# Altium project LPC55S69_MINI [A].PrjPcb
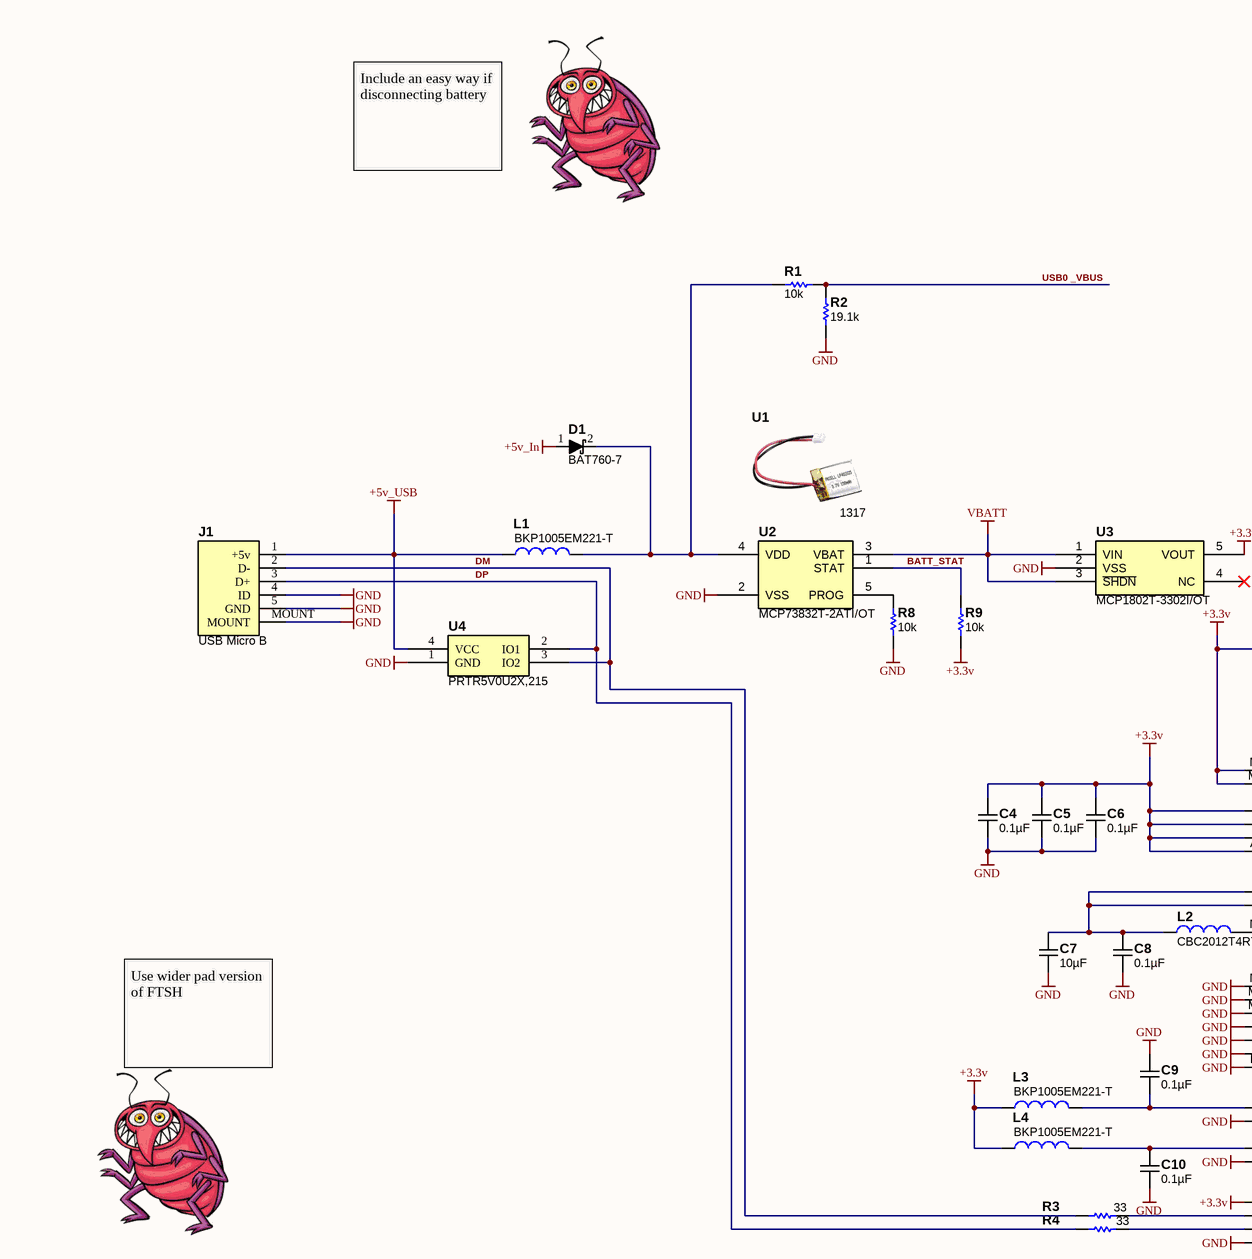
[diagram p0: LPC55S69_MINI [A].SchDoc, top left]
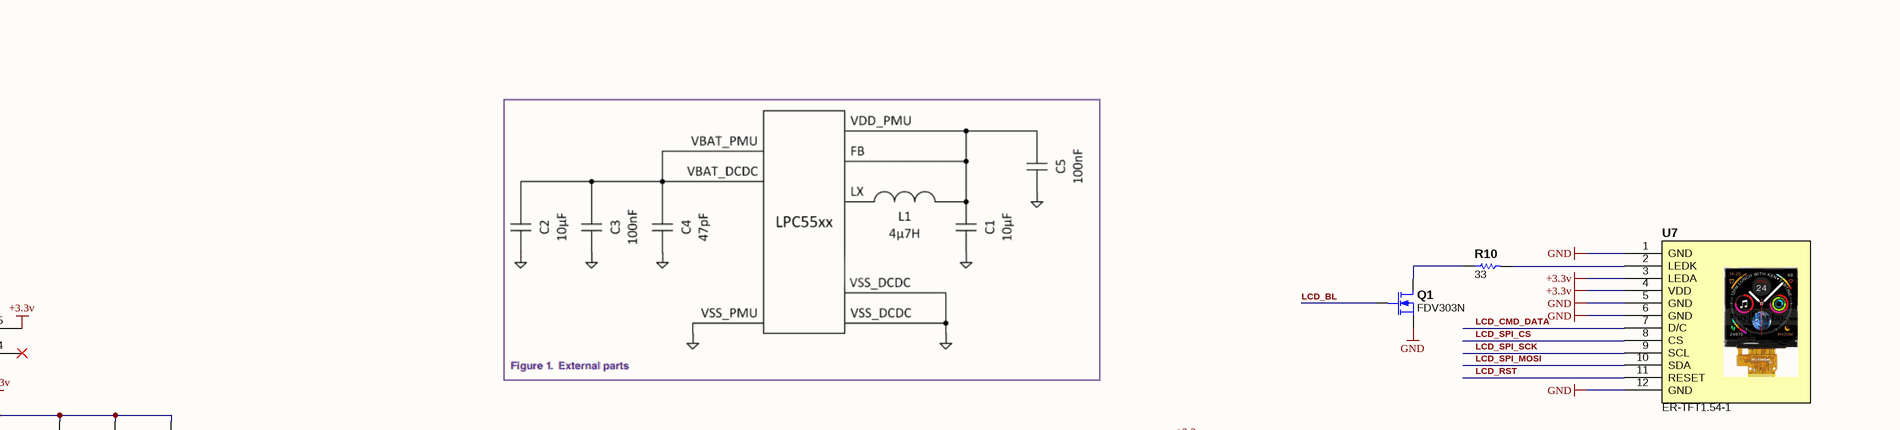
[diagram p1: LPC55S69_MINI [A].SchDoc, top right]
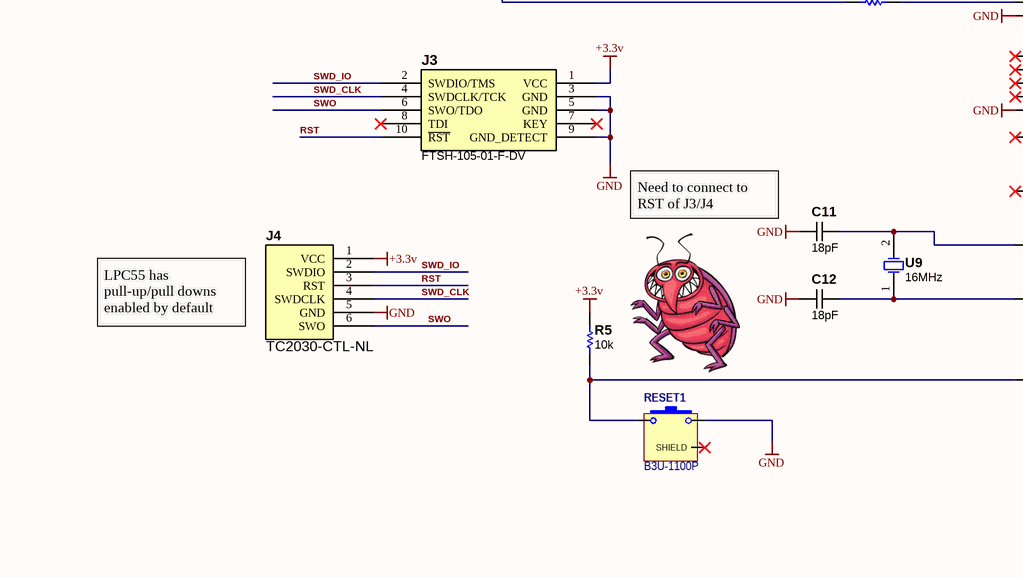
[diagram p2: LPC55S69_MINI [A].SchDoc, bottom left]
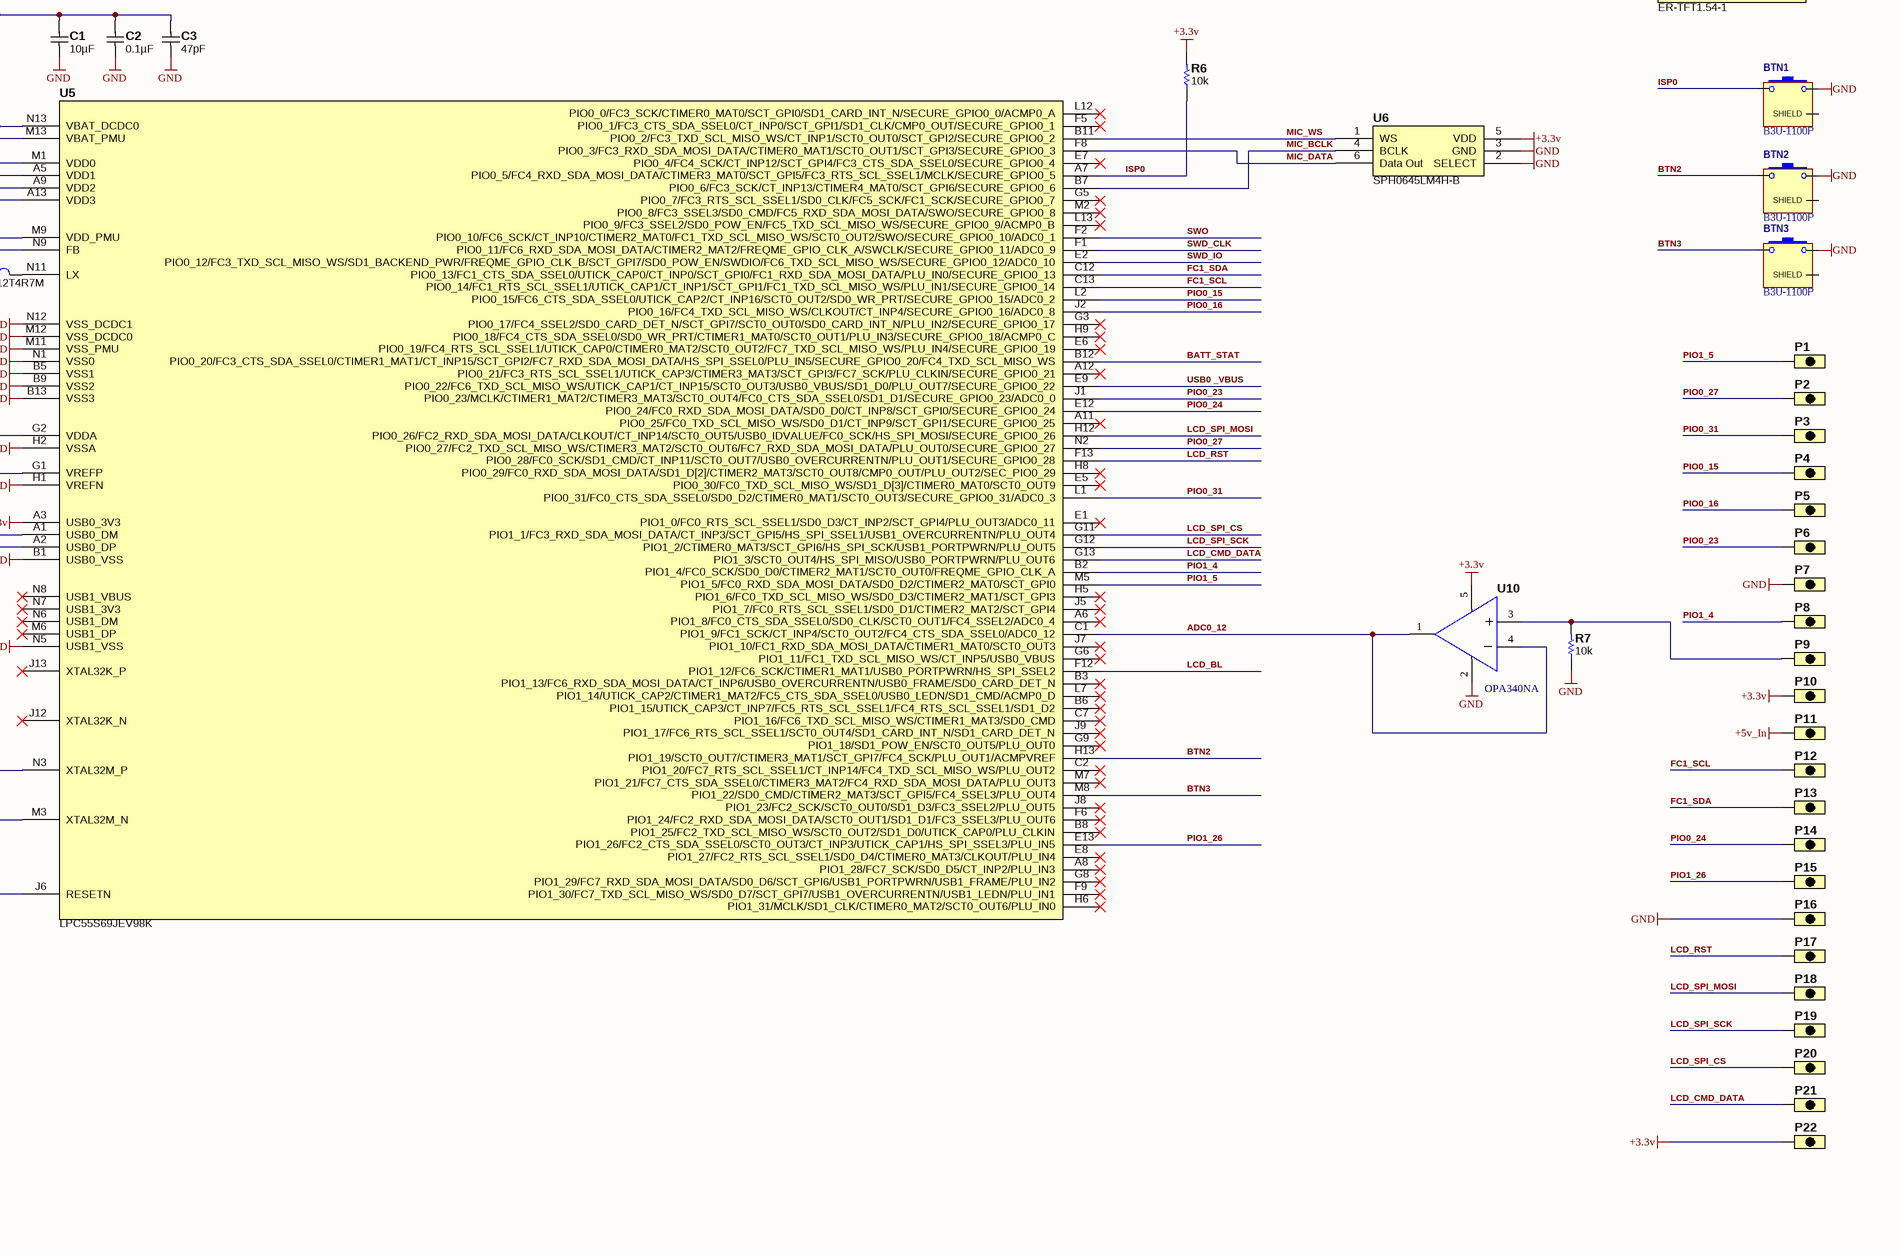
[diagram p3: LPC55S69_MINI [A].SchDoc, bottom right]
APPROVAL_APPROVED_1: -; APPROVAL_APPROVED_1_DATE: -; APPROVAL_APPROVED_2: -; APPROVAL_APPROVED_2_DATE: -; APPROVAL_CHECKED_DATE: -; APPROVAL_DRAWN: -; APPROVAL_DRAWN_DATE: -; APPROVAL_ENGINEER: -; APPROVAL_ENGINEER_DATE: -; APPROVAL_REVIEWED: -; APPROVAL_REVIEWED_DATE: -; BOM_NOTES_LINE_1: -; BOM_NOTES_LINE_2: -; BOM_NOTES_LINE_3: -; BOM_NOTES_LINE_4: -; CCA_PART_NUMBER: LPC55S69_MINI; CCA_TITLE: LPC55S69_MINI; PCB_COPPER_WEIGHT_INNER: 1oz; PCB_COPPER_WEIGHT_OUTER: 1oz; PCB_DRC_DATE: X; PCB_FINISH_PLATING: GOLD ENIG; PCB_FINISHED_THICKNESS: 62.5mil; PCB_LAYERS: 2; PCB_MATERIAL: FR4; PCB_MIN_DRILL: 12mil; PCB_MIN_TRACE_SPACE: 6mil; PCB_MIN_TRACE_WIDTH: 6mil; PCB_PART_NUMBER: LPC55S69_MINI; PCB_PRINTOUT_SCALE: 1:1; PCB_SILKSCREEN_COLOR_BOTTOM: WHITE; PCB_SILKSCREEN_COLOR_TOP: WHITE; PCB_SOLDER_MASK_COLOR_BOTTOM: GREEN; PCB_SOLDER_MASK_COLOR_TOP: GREEN; PCB_TITLE: LPC55S69_MINI; PCB_VERSION: A; PROJECT_ENGINEER: E. Hughes; PROJECT_STATUS: PRODUCTION; PROJECT_TITLE_LINE_1: LPC55S69_MINI; SCH_DATE: 2019-01-28
1 sheet, 66 parts. Net scope: global (net labels, ports and power ports of the same name join across sheets).
Board file: LPC55S69_MINI [A].PCBdoc

## Sheet LPC55S69_MINI [A].SchDoc
size D; Organization: Altium Limited; Address1: 3 Minna Close; Address2: Belrose; Address3: NSW 2085; Address4: Australia; DocumentNumber: 1; SheetNumber: 1; SheetTotal: 1

### Parts
BTN1  B3U-1100P  [OMRON_B3U-1100P]
BTN2  B3U-1100P  [OMRON_B3U-1100P]
BTN3  B3U-1100P  [OMRON_B3U-1100P]
C1  10µF  [C0805_1.45MM_MD]
C2  0.1µF  [C0402_0.55MM_MD]
C3  47pF  [C0402_0.55MM_MD]
C4  0.1µF  [C0402_0.55MM_MD]
C5  0.1µF  [C0402_0.55MM_MD]
C6  0.1µF  [C0402_0.55MM_MD]
C7  10µF  [C0805_1.45MM_MD]
C8  0.1µF  [C0402_0.55MM_MD]
C9  0.1µF  [C0402_0.55MM_MD]
C10  0.1µF  [C0402_0.55MM_MD]
C11  18pF  [C0402_0.55MM_MD]
C12  18pF  [C0402_0.55MM_MD]
D1  BAT760-7  [D_SOD-323_P]
J1  USB Micro B  [10103594-0001LF]
J3  FTSH-105-01-F-DV  [FTSH-105-04-F-DV - HD - NO_STEP]
J4  TC2030‐CTL‐NL  [TC2030 NO LATCH]  (no BOM)
L1  BKP1005EM221-T  [C0402_HD]
L2  CBC2012T4R7M  [C0805_1.45MM_MD]
L3  BKP1005EM221-T  [C0402_HD]
L4  BKP1005EM221-T  [C0402_HD]
P1  (no value)  [CASTELLATED]  (no BOM)
P2  (no value)  [CASTELLATED]  (no BOM)
P3  (no value)  [CASTELLATED]  (no BOM)
P4  (no value)  [CASTELLATED]  (no BOM)
P5  (no value)  [CASTELLATED]  (no BOM)
P6  (no value)  [CASTELLATED]  (no BOM)
P7  (no value)  [CASTELLATED]  (no BOM)
P8  (no value)  [CASTELLATED]  (no BOM)
P9  (no value)  [CASTELLATED]  (no BOM)
P10  (no value)  [CASTELLATED]  (no BOM)
P11  (no value)  [CASTELLATED]  (no BOM)
P12  (no value)  [CASTELLATED]  (no BOM)
P13  (no value)  [CASTELLATED]  (no BOM)
P14  (no value)  [CASTELLATED]  (no BOM)
P15  (no value)  [CASTELLATED]  (no BOM)
P16  (no value)  [CASTELLATED]  (no BOM)
P17  (no value)  [CASTELLATED]  (no BOM)
P18  (no value)  [CASTELLATED]  (no BOM)
P19  (no value)  [CASTELLATED]  (no BOM)
P20  (no value)  [CASTELLATED]  (no BOM)
P21  (no value)  [CASTELLATED]  (no BOM)
P22  (no value)  [CASTELLATED]  (no BOM)
Q1  FDV303N  [SOT-23]
R1  10k  [R0402_0.40MM_MD]
R2  19.1k  [R0402_0.40MM_MD]
R3  33  [R0603_0.55MM_MD]
R4  33  [R0603_0.55MM_MD]
R5  10k  [R0402_0.40MM_MD]
R6  10k  [R0402_0.40MM_MD]
R7  10k  [R0402_0.40MM_MD]
R8  10k  [R0402_0.40MM_MD]
R9  10k  [R0402_0.40MM_MD]
R10  33  [R0603_0.55MM_MD]
RESET1  B3U-1100P  [OMRON_B3U-1100P]
U1  1317  [LIPO-150MAH]
U2  MCP73832T-2ATI/OT  [SOT23-5]
U3  MCP1802T-3302I/OT  [SOT23-5]
U4  PRTR5V0U2X,215  [SOT143B]
U5  LPC55S69JEV98K  [98-VFBGA]
U6  SPH0645LM4H-B  [SPH0645LM4H-B]
U7  ER-TFT1.54-1  [ER-TFT1.54-1]
U9  16MHz  [ABM3]
U10  value OPA340NA  [SOT95P245X145-5L]  (hidden comment: IC SINGLE SUPPLY OPAMP SOT-23-5)

### Nets
+3.3v: C1.2 C2.2 C3.2 C4.2 C5.2 C6.2 J3.1(VCC) J4.1(VCC) L3.1 L4.1 P10.1 P22.1 R5.2 R6.2 R9.1 U3.5(VOUT) U5.A3(USB0_3V3) U5.A5(VDD1) U5.A9(VDD2) U5.A13(VDD3) U5.M1(VDD0) U5.M13(VBAT_PMU) U5.N13(VBAT_DCDC0) U6.5(VDD) U7.3(LEDA) U7.4(VDD) U10.5(VCC)
+5v_In: D1.1(A) P11.1
+5v_USB: J1.1(+5v) L1.1 U4.4(VCC)
GND: BTN1.1 BTN2.1 BTN3.1 C1.1 C2.1 C3.1 C4.1 C5.1 C6.1 C7.1 C8.1 C9.2 C10.1 C11.1 C12.1 J1.4(ID) J1.5(GND) J1.MOUNT J3.3(GND) J3.5(GND) J3.9(GND_DETECT) J4.5(GND) P7.1 P16.1 Q1.2(S) R2.1 R7.1 R8.1 RESET1.1 U2.2(VSS) U3.2(VSS) U4.1(GND) U5.B1(USB0_VSS) U5.B5(VSS1) U5.B9(VSS2) U5.B13(VSS3) U5.H1(VREFN) U5.H2(VSSA) U5.M11(VSS_PMU) U5.M12(VSS_DCDC0) U5.N1(VSS0) U5.N5(USB1_VSS) U5.N12(VSS_DCDC1) U6.2(SELECT) U6.3(GND) U7.1(GND) U7.5(GND) U7.6(GND) U7.12(GND) U10.2(GND)
VBATT: U2.3(VBAT) U3.1(VIN) U3.3(~{SHDN})
ADC0_12: U5.C1(PIO1_9/FC1_SCK/CT_INP4/SCT0_OUT2/FC4_CTS_SDA_SSEL0/ADC0_12) U10.1(OUT) U10.4(-)
BATT_STAT: R9.2 U2.1(STAT) U5.B12(PIO0_20/FC3_CTS_SDA_SSEL0/CTIMER1_MAT1/CT_INP15/SCT_GPI2/FC7_RXD_SDA_MOSI_DATA/HS_SPI_SSEL0/PLU_IN5/SECURE_GPIO0_20/FC4_TXD_SCL_MISO_WS)
BTN2: BTN2.2 U5.H13(PIO1_19/SCT0_OUT7/CTIMER3_MAT1/SCT_GPI7/FC4_SCK/PLU_OUT1/ACMPVREF)
BTN3: BTN3.2 U5.M8(PIO1_22/SD0_CMD/CTIMER2_MAT3/SCT_GPI5/FC4_SSEL3/PLU_OUT4)
DM: J1.2(D-) R3.1 U4.3(IO2)
DP: J1.3(D+) R4.1 U4.2(IO1)
FC1_SCL: P12.1 U5.C13(PIO0_14/FC1_RTS_SCL_SSEL1/UTICK_CAP1/CT_INP1/SCT_GPI1/FC1_TXD_SCL_MISO_WS/PLU_IN1/SECURE_GPIO0_14)
FC1_SDA: P13.1 U5.C12(PIO0_13/FC1_CTS_SDA_SSEL0/UTICK_CAP0/CT_INP0/SCT_GPI0/FC1_RXD_SDA_MOSI_DATA/PLU_IN0/SECURE_GPIO0_13)
ISP0: BTN1.2 R6.1 U5.A7(PIO0_5/FC4_RXD_SDA_MOSI_DATA/CTIMER3_MAT0/SCT_GPI5/FC3_RTS_SCL_SSEL1/MCLK/SECURE_GPIO0_5)
LCD_BL: Q1.1(G) U5.F12(PIO1_12/FC6_SCK/CTIMER1_MAT1/USB0_PORTPWRN/HS_SPI_SSEL2)
LCD_CMD_DATA: P21.1 U5.G13(PIO1_3/SCT0_OUT4/HS_SPI_MISO/USB0_PORTPWRN/PLU_OUT6) U7.7(D/C)
LCD_RST: P17.1 U5.F13(PIO0_28/FC0_SCK/SD1_CMD/CT_INP11/SCT0_OUT7/USB0_OVERCURRENTN/PLU_OUT1/SECURE_GPIO0_28) U7.11(RESET)
LCD_SPI_CS: P20.1 U5.G11(PIO1_1/FC3_RXD_SDA_MOSI_DATA/CT_INP3/SCT_GPI5/HS_SPI_SSEL1/USB1_OVERCURRENTN/PLU_OUT4) U7.8(CS)
LCD_SPI_MOSI: P18.1 U5.H12(PIO0_26/FC2_RXD_SDA_MOSI_DATA/CLKOUT/CT_INP14/SCT0_OUT5/USB0_IDVALUE/FC0_SCK/HS_SPI_MOSI/SECURE_GPIO0_26) U7.10(SDA)
LCD_SPI_SCK: P19.1 U5.G12(PIO1_2/CTIMER0_MAT3/SCT_GPI6/HS_SPI_SCK/USB1_PORTPWRN/PLU_OUT5) U7.9(SCL)
MIC_BCLK: U5.B7(PIO0_6/FC3_SCK/CT_INP13/CTIMER4_MAT0/SCT_GPI6/SECURE_GPIO0_6) U6.4(BCLK)
MIC_DATA: U5.F8(PIO0_3/FC3_RXD_SDA_MOSI_DATA/CTIMER0_MAT1/SCT0_OUT1/SCT_GPI3/SECURE_GPIO0_3) U6.6(Data_Out)
MIC_WS: U5.B11(PIO0_2/FC3_TXD_SCL_MISO_WS/CT_INP1/SCT0_OUT0/SCT_GPI2/SECURE_GPIO0_2) U6.1(WS)
PIO0_15: P4.1 U5.L2(PIO0_15/FC6_CTS_SDA_SSEL0/UTICK_CAP2/CT_INP16/SCT0_OUT2/SD0_WR_PRT/SECURE_GPIO0_15/ADC0_2)
PIO0_16: P5.1 U5.J2(PIO0_16/FC4_TXD_SCL_MISO_WS/CLKOUT/CT_INP4/SECURE_GPIO0_16/ADC0_8)
PIO0_23: P6.1 U5.J1(PIO0_23/MCLK/CTIMER1_MAT2/CTIMER3_MAT3/SCT0_OUT4/FC0_CTS_SDA_SSEL0/SD1_D1/SECURE_GPIO0_23/ADC0_0)
PIO0_24: P14.1 U5.E12(PIO0_24/FC0_RXD_SDA_MOSI_DATA/SD0_D0/CT_INP8/SCT_GPI0/SECURE_GPIO0_24)
PIO0_27: P2.1 U5.N2(PIO0_27/FC2_TXD_SCL_MISO_WS/CTIMER3_MAT2/SCT0_OUT6/FC7_RXD_SDA_MOSI_DATA/PLU_OUT0/SECURE_GPIO0_27)
PIO0_31: P3.1 U5.L1(PIO0_31/FC0_CTS_SDA_SSEL0/SD0_D2/CTIMER0_MAT1/SCT0_OUT3/SECURE_GPIO0_31/ADC0_3)
PIO1_4: P8.1 U5.B2(PIO1_4/FC0_SCK/SD0_D0/CTIMER2_MAT1/SCT0_OUT0/FREQME_GPIO_CLK_A)
PIO1_5: P1.1 U5.M5(PIO1_5/FC0_RXD_SDA_MOSI_DATA/SD0_D2/CTIMER2_MAT0/SCT_GPI0)
PIO1_26: P15.1 U5.E13(PIO1_26/FC2_CTS_SDA_SSEL0/SCT0_OUT3/CT_INP3/UTICK_CAP1/HS_SPI_SSEL3/PLU_IN5)
RST: J3.10(~{RST}) J4.3(RST)
SWD_CLK: J3.4(SWDCLK/TCK) J4.4(SWDCLK) U5.F1(PIO0_11/FC6_RXD_SDA_MOSI_DATA/CTIMER2_MAT2/FREQME_GPIO_CLK_A/SWCLK/SECURE_GPIO0_11/ADC0_9)
SWD_IO: J3.2(SWDIO/TMS) J4.2(SWDIO) U5.E2(PIO0_12/FC3_TXD_SCL_MISO_WS/SD1_BACKEND_PWR/FREQME_GPIO_CLK_B/SCT_GPI7/SD0_POW_EN/SWDIO/FC6_TXD_SCL_MISO_WS/SECURE_GPIO0_12/ADC0_10)
SWO: J3.6(SWO/TDO) J4.6(SWO) U5.F2(PIO0_10/FC6_SCK/CT_INP10/CTIMER2_MAT0/FC1_TXD_SCL_MISO_WS/SCT0_OUT2/SWO/SECURE_GPIO0_10/ADC0_1)
USB0 _VBUS: R1.2 R2.2 U5.E9(PIO0_22/FC6_TXD_SCL_MISO_WS/UTICK_CAP1/CT_INP15/SCT0_OUT3/USB0_VBUS/SD1_D0/PLU_OUT7/SECURE_GPIO0_22)
NetC7_2: C7.2 C8.2 L2.1 U5.M9(VDD_PMU) U5.N9(FB)
NetC9_1: C9.1 L3.2 U5.G2(VDDA)
NetC10_2: C10.2 L4.2 U5.G1(VREFP)
NetC11_2: C11.2 U5.N3(XTAL32M_P) U9.2(OSC2)
NetC12_2: C12.2 U5.M3(XTAL32M_N) U9.1(OSC1)
NetD1_2: D1.2(K) L1.2 R1.1 U2.4(VDD)
NetL2_2: L2.2 U5.N11(LX)
NetP9_1: P9.1 R7.2 U10.3(+)
NetQ1_3: Q1.3(D) R10.1
NetR3_2: R3.2 U5.A1(USB0_DM)
NetR4_2: R4.2 U5.A2(USB0_DP)
NetR5_1: R5.1 RESET1.2 U5.J6(RESETN)
NetR8_2: R8.2 U2.5(PROG)
NetR10_2: R10.2 U7.2(LEDK)

Not connected (* = marked no-connect by the designer): BTN1 S(SHIELD); BTN2 S(SHIELD); BTN3 S(SHIELD); J3 7(KEY)* 8(TDI)*; RESET1 S(SHIELD)*; U3 4(NC)*; U5 A6(PIO1_8/FC0_CTS_SDA_SSEL0/SD0_CLK/SCT0_OUT1/FC4_SSEL2/ADC0_4)* A8(PIO1_28/FC7_SCK/SD0_D5/CT_INP2/PLU_IN3)* A11(PIO0_25/FC0_TXD_SCL_MISO_WS/SD0_D1/CT_INP9/SCT_GPI1/SECURE_GPIO0_25)* A12(PIO0_21/FC3_RTS_SCL_SSEL1/UTICK_CAP3/CTIMER3_MAT3/SCT_GPI3/FC7_SCK/PLU_CLKIN/SECURE_GPIO0_21)* B3(PIO1_13/FC6_RXD_SDA_MOSI_DATA/CT_INP6/USB0_OVERCURRENTN/USB0_FRAME/SD0_CARD_DET_N)* B6(PIO1_15/UTICK_CAP3/CT_INP7/FC5_RTS_SCL_SSEL1/FC4_RTS_SCL_SSEL1/SD1_D2)* B8(PIO1_25/FC2_TXD_SCL_MISO_WS/SCT0_OUT2/SD1_D0/UTICK_CAP0/PLU_CLKIN)* C2(PIO1_20/FC7_RTS_SCL_SSEL1/CT_INP14/FC4_TXD_SCL_MISO_WS/PLU_OUT2)* C7(PIO1_16/FC6_TXD_SCL_MISO_WS/CTIMER1_MAT3/SD0_CMD)* E1(PIO1_0/FC0_RTS_SCL_SSEL1/SD0_D3/CT_INP2/SCT_GPI4/PLU_OUT3/ADC0_11)* E5(PIO0_30/FC0_TXD_SCL_MISO_WS/SD1_D[3]/CTIMER0_MAT0/SCT0_OUT9)* E6(PIO0_19/FC4_RTS_SCL_SSEL1/UTICK_CAP0/CTIMER0_MAT2/SCT0_OUT2/FC7_TXD_SCL_MISO_WS/PLU_IN4/SECURE_GPIO0_19)* E7(PIO0_4/FC4_SCK/CT_INP12/SCT_GPI4/FC3_CTS_SDA_SSEL0/SECURE_GPIO0_4)* E8(PIO1_27/FC2_RTS_SCL_SSEL1/SD0_D4/CTIMER0_MAT3/CLKOUT/PLU_IN4)* F5(PIO0_1/FC3_CTS_SDA_SSEL0/CT_INP0/SCT_GPI1/SD1_CLK/CMP0_OUT/SECURE_GPIO0_1)* F6(PIO1_24/FC2_RXD_SDA_MOSI_DATA/SCT0_OUT1/SD1_D1/FC3_SSEL3/PLU_OUT6)* F9(PIO1_30/FC7_TXD_SCL_MISO_WS/SD0_D7/SCT_GPI7/USB1_OVERCURRENTN/USB1_LEDN/PLU_IN1)* G3(PIO0_17/FC4_SSEL2/SD0_CARD_DET_N/SCT_GPI7/SCT0_OUT0/SD0_CARD_INT_N/PLU_IN2/SECURE_GPIO0_17)* G5(PIO0_7/FC3_RTS_SCL_SSEL1/SD0_CLK/FC5_SCK/FC1_SCK/SECURE_GPIO0_7)* G6(PIO1_11/FC1_TXD_SCL_MISO_WS/CT_INP5/USB0_VBUS)* G8(PIO1_29/FC7_RXD_SDA_MOSI_DATA/SD0_D6/SCT_GPI6/USB1_PORTPWRN/USB1_FRAME/PLU_IN2)* G9(PIO1_18/SD1_POW_EN/SCT0_OUT5/PLU_OUT0)* H5(PIO1_6/FC0_TXD_SCL_MISO_WS/SD0_D3/CTIMER2_MAT1/SCT_GPI3)* H6(PIO1_31/MCLK/SD1_CLK/CTIMER0_MAT2/SCT0_OUT6/PLU_IN0)* H8(PIO0_29/FC0_RXD_SDA_MOSI_DATA/SD1_D[2]/CTIMER2_MAT3/SCT0_OUT8/CMP0_OUT/PLU_OUT2/SEC_PIO0_29)* H9(PIO0_18/FC4_CTS_SDA_SSEL0/SD0_WR_PRT/CTIMER1_MAT0/SCT0_OUT1/PLU_IN3/SECURE_GPIO0_18/ACMP0_C)* J5(PIO1_7/FC0_RTS_SCL_SSEL1/SD0_D1/CTIMER2_MAT2/SCT_GPI4)* J7(PIO1_10/FC1_RXD_SDA_MOSI_DATA/CTIMER1_MAT0/SCT0_OUT3)* J8(PIO1_23/FC2_SCK/SCT0_OUT0/SD1_D3/FC3_SSEL2/PLU_OUT5)* J9(PIO1_17/FC6_RTS_SCL_SSEL1/SCT0_OUT4/SD1_CARD_INT_N/SD1_CARD_DET_N)* J12(XTAL32K_N)* J13(XTAL32K_P)* L7(PIO1_14/UTICK_CAP2/CTIMER1_MAT2/FC5_CTS_SDA_SSEL0/USB0_LEDN/SD1_CMD/ACMP0_D)* L12(PIO0_0/FC3_SCK/CTIMER0_MAT0/SCT_GPI0/SD1_CARD_INT_N/SECURE_GPIO0_0/ACMP0_A)* L13(PIO0_9/FC3_SSEL2/SD0_POW_EN/FC5_TXD_SCL_MISO_WS/SECURE_GPIO0_9/ACMP0_B)* M2(PIO0_8/FC3_SSEL3/SD0_CMD/FC5_RXD_SDA_MOSI_DATA/SWO/SECURE_GPIO0_8)* M6(USB1_DP)* M7(PIO1_21/FC7_CTS_SDA_SSEL0/CTIMER3_MAT2/FC4_RXD_SDA_MOSI_DATA/PLU_OUT3)* N6(USB1_DM)* N7(USB1_3V3)* N8(USB1_VBUS)*

### Notes on the sheet
- Include an easy way if disconnecting battery
- Use wider pad version of FTSH
- (near C11) Need to connect to RST of J3/J4
- LPC55 has pull-up/pull downs enabled by default
- PCB REV
- CCA REV
- Sheet
- of

### Library data of the parts
BTN1-BTN3 RESET1 = B3U-1100P: SWITCH TACTILE SPST-NO 0.05A 12V; Manufacturer: Omron Electronics Inc-EMC Div; CategorySort: 700; Switch Function: Off-Mom; Contact Rating @ Voltage: 0.05A @ 12VDC; Actuator Type: Standard; Actuator Height off PCB, from Pins: 1.60mm; Actuator Orientation: Top Actuated; Outline: 3.00mm x 2.50mm; Illumination: Non-Illuminated; Operating Force: 153gf; Ingress Protection: Dust Proof; Switch Travel: 0.15mm; Mechanical Life: 200,000 Cycles; Value: B3U-1100P; Sort Value: *; Category: Switches; Supplier 1: Digi-Key; Supplier Part Number 1: SW1021CT-ND; Manufacturer Part Number: B3U-1100P; RoHS: RoHS Compliant; Stock 1: 45170; Pricing 1: 1=1.25, 10=1.201, 25=1.1332, 50=0.997, 100=0.9064, 250=0.86108, 500=0.83842, 1000=0.65714 (USD); Packaging: Cut Tape (CT); Circuit: SPST-NO; Mounting Type: Surface Mount; Termination Style: SMD (SMT) Tab; Illumination Voltage (Nominal): -; Illumination Type, Color: -; Features: Grounding Pin; Actuator Material: -; Operating Temperature: -25°C ~ 70°C; ComponentLink1URL: http://www.components.omron.com/components/web/PDFLIB.nsf/0/2DD3893C7DD33E9E862572900079E9D6/$file/B3U_1110.pdf; ComponentLink1Description: http://www.components.omron.com/components/web/PDFLIB.nsf/0/2DD3893C7DD33E9E862572900079E9D6/$file/B3U_1110.pdf
C1 C7 = CGA4J1X7R0J106K125AC: CAP CER 10UF 6.3V X7R 0805; Manufacturer: TDK Corporation; Tolerance: ±10%; Substitution Notes: 10µF , 6.3V , ±10% , X7R , -55°C ~ 125°C , AEC-Q200 , 0805; Value: 10µF; Temperature Coefficient: X7R; Manufacturer Part Number: CGA4J1X7R0J106K125AC; ComponentLink1Description: Datasheet (Internal); ComponentLink1URL: datasheets\TDK\mlcc_automotive_general_en.pdf; ComponentLink2Description: Datasheet (External); ComponentLink2URL: https://product.tdk.com/info/en/catalog/datasheets/mlcc_automotive_general_en.pdf; Supplier 1: Digikey; Supplier Part Number 1: 445-6971-1-ND; Category: Capacitors; Voltage - Rated: 6.3V; Features: -; Operating Temperature: -55°C ~ 125°C; Ratings: AEC-Q200; Package: 0805; Thickness (Max): 1.45MM
C2 C4-C6 C8-C10 = CGA2B1X7R1C104K050BC: CAP CER 0.1UF 16V X7R 0402; Manufacturer: TDK Corporation; Tolerance: ±10%; Substitution Notes: 0.1µF , 16V , ±10% , X7R , -55°C ~ 125°C , AEC-Q200 , 0402; Value: 0.1µF; Temperature Coefficient: X7R; Manufacturer Part Number: CGA2B1X7R1C104K050BC; ComponentLink1Description: Datasheet (Internal); ComponentLink1URL: datasheets\TDK\mlcc_automotive_general_en.pdf; ComponentLink2Description: Datasheet (External); ComponentLink2URL: https://product.tdk.com/info/en/catalog/datasheets/mlcc_automotive_general_en.pdf; Supplier 1: Digikey; Supplier Part Number 1: 445-5613-1-ND; Category: Capacitors; Voltage - Rated: 16V; Features: -; Operating Temperature: -55°C ~ 125°C; Ratings: AEC-Q200; Package: 0402; Thickness (Max): 0.55MM
C3 = CGA2B2C0G1H470J050BA: CAP CER 47PF 50V C0G 0402; Manufacturer: TDK Corporation; Temperature Coefficient: C0G, NP0; Tolerance: ±5%; Substitution Notes: 47pF , 50V , ±5% , C0G, NP0 , -55°C ~ 125°C , AEC-Q200 , 0402; Value: 47pF; Manufacturer Part Number: CGA2B2C0G1H470J050BA; ComponentLink1Description: Datasheet (Internal); ComponentLink1URL: datasheets\TDK\mlcc_automotive_general_en.pdf; ComponentLink2Description: Datasheet (External); ComponentLink2URL: https://product.tdk.com/info/en/catalog/datasheets/mlcc_automotive_general_en.pdf; Supplier 1: Digikey; Supplier Part Number 1: 445-5592-1-ND; Category: Capacitors; Voltage - Rated: 50V; Features: -; Operating Temperature: -55°C ~ 125°C; Ratings: AEC-Q200; Package: 0402; Thickness (Max): 0.55MM
C11 C12 = CGA2B2C0G1H180J050BA: CAP CER 18PF 50V C0G 0402; Manufacturer: TDK Corporation; Temperature Coefficient: C0G, NP0; Tolerance: ±5%; Substitution Notes: 18pF , 50V , ±5% , C0G, NP0 , -55°C ~ 125°C , AEC-Q200 , 0402; Value: 18pF; Manufacturer Part Number: CGA2B2C0G1H180J050BA; ComponentLink1Description: Datasheet (Internal); ComponentLink1URL: datasheets\TDK\mlcc_automotive_general_en.pdf; ComponentLink2Description: Datasheet (External); ComponentLink2URL: https://product.tdk.com/info/en/catalog/datasheets/mlcc_automotive_general_en.pdf; Supplier 1: Digikey; Supplier Part Number 1: 445-5587-1-ND; Category: Capacitors; Voltage - Rated: 50V; Features: -; Operating Temperature: -55°C ~ 125°C; Ratings: AEC-Q200; Package: 0402; Thickness (Max): 0.55MM
D1 = BAT760-7: DIODE SCHOTTKY 30V 1A SOD323; Manufacturer: Diodes Inc; CategorySort: 400; Voltage - Forward (Vf) (Max) @ If: 550mV @ 1A; Speed: Fast Recovery =< 500ns- > 200mA (Io); Current - Reverse Leakage @ Vr: 50µA @ 15V; Capacitance @ Vr- F: 25pF @ 5V- 1MHz; Num Pins: 2; Diode Suffix: 1A_2C; Category: Diodes; Value: BAT760-7; Manufacturer Part Number: BAT760-7; ComponentLink1Description: Internal Datasheet; ComponentLink1URL: http://www.diodes.com/datasheets/ds30498.pdf; ComponentLink2Description: External Datasheet; ComponentLink2URL: http://www.diodes.com/datasheets/ds30498.pdf; Supplier 1: Digi-Key; Supplier Part Number 1: BAT760DICT-ND; SortValue: BAT760-7; Diode Type: Schottky; Voltage - DC Reverse (Vr) (Max): 30V; Current - Average Rectified (Io): 1A; Reverse Recovery Time (trr): -; Mounting Type: Surface Mount; Package: SC-76- SOD-323; Supplier Device Package: SOD-323; Packaging: Cut Tape (CT)
J1 = 10103594-0001LF: CONN RCPT STD MICRO USB TYPE B; Manufacturer: FCI; Connector Type: USB - micro B; Number of Contacts: 5; Gender: Receptacle; Specifications: USB 2.0; Micro USB B: Value; Notes: Similar to; Supplier 1: Digi-Key; Manufacturer Part Number: 10103594-0001LF; RoHS: RoHS Compliant; Category: Connectors, Interconnects; Stock 1: 23288; Pricing 1: 1=1.1, 10=0.768, 100=0.517, 250=0.43912, 500=0.41716 (USD); Mounting Type: Surface Mount, Right Angle, Horizontal; Features: Shielded, Solder Retention; Packaging: Cut Tape (CT); Ingress Protection: -; ComponentLink1URL: http://portal.fciconnect.com/res/en/pdffiles/doc_search/10103594.pdf; ComponentLink1Description: http://portal.fciconnect.com/res/en/pdffiles/doc_search/10103594.pdf; Supplier Part Number 1: 609-4050-1-ND; Value: USB Micro B
J3 = CORTEX-DEBUG: SAMTEC - FTSH-105-01-F-DV - .050 X .050; Value: FTSH-105-01-F-DV; Supplier 1: Newark; Manufacturer: SAMTEC; Manufacturer Part Number: FTSH-105-01-F-DV; Category: Connectors; Stock 1: 0; Pricing 1: 1=0.974, 25000=0.835, 50000=0.774 (USD); Supplier Part Number 1: 01R3399
J4 = TC2030‐CTL‐NL: Tag Connect Pads - No latching Clips - ARM; Value: TC2030‐CTL‐NL
L1 L3 L4 = BKP1005EM221-T: FERRITE BEAD 220 OHM 0402 1LN; Manufacturer: Taiyo Yuden; Filter Type: Power Line; Number of Lines: 1; Impedance @ Frequency: 220 Ohm @ 100MHz; Current Rating (Max): 1A; DC Resistance (DCR) (Max): 150 mOhm; Supplier 1: Digi-Key; Supplier Part Number 1: 587-3290-2-ND; Manufacturer Part Number: BKP1005EM221-T; RoHS: RoHS Compliant; Category: Filters; Stock 1: 60000; Pricing 1: 10000=0.0145, 20000=0.014, 30000=0.013, 50000=0.01285 (USD); Packaging: Tape & Reel (TR); Ratings: -; Operating Temperature: -55°C ~ 85°C; Package / Case: 0402 (1005 Metric); Mounting Type: Surface Mount; Height (Max): 0.022" (0.55mm); Size / Dimension: 0.039" L x 0.022" W (1.00mm x 0.55mm); ComponentLink1URL: http://ds.yuden.co.jp/TYCOMPAS/ut/detail.do?productNo=BKP1005EM221-T&fileName=BKP1005EM221-T_SS&mode=specSheetDownload; ComponentLink1Description: http://ds.yuden.co.jp/TYCOMPAS/ut/detail.do?productNo=BKP1005EM221-T&fileName=BKP1005EM221-T_SS&mode=specSheetDownload; Value: BKP1005EM221-T
L2 = CBC2012T4R7M: FIXED IND 4.7UH 520MA 650 MOHM; Manufacturer: Taiyo Yuden; Core Material: Ferrite; Tolerance: 20%; Self Resonant Frequency: 45MHz; DC Resistance (DCR): 650mR; Test Frequency: 7.96MHz; Saturation Current: 360mA; Shielding: Unshielded; Value: CBC2012T4R7M; Supplier 1: Digi-Key; Manufacturer Part Number: CBC2012T4R7M; Stock 1: 7720; Pricing 1: 1=0.24000, 10=0.21600, 100=0.14860, 500=0.12702, 1000=0.09729 (USD); RoHS: Yes; Mount: Surface Mount; Case/Package: 0805; Number of Pins: 2; Case Code (Metric): 2012; Case Code (Imperial): 0805; Min Operating Temperature: -40°C; Max Operating Temperature: 105°C; Packaging: Tape and Reel; Inductance: 4.7uH; Max DC Current: 520mA; Termination: SMD/SMT; Inductance Tolerance: 20%; Package Quantity: 3000; Current Rating: 520mA; Composition: Wirewound; Length: 0.079inch; Height: 1.25mm; Width: 0.049inch; Height - Seated (Max): 0.057inch; REACH SVHC: No SVHC; Lead Free: Exempt; Halogen Free: Halogen Free; ComponentLink1URL: https://datasheet.ciiva.com/15981/214cbc2012t4r7m-15981637.pdf?src-supplier=Onlinecomponents.com; ComponentLink1Description: https://datasheet.ciiva.com/15981/214cbc2012t4r7m-15981637.pdf?src-supplier=Onlinecomponents.com; ComponentLink2URL: https://datasheet.ciiva.com/1040/cbc2012t4r7m-ss-1040456.pdf?src-supplier=Digi-Key; ComponentLink2Description: https://datasheet.ciiva.com/1040/cbc2012t4r7m-ss-1040456.pdf?src-supplier=Digi-Key; ComponentLink3URL: https://datasheet.ciiva.com/8505/cbc2012t4r7m-ss-8505656.pdf?src-supplier=Avnet; ComponentLink3Description: https://datasheet.ciiva.com/8505/cbc2012t4r7m-ss-8505656.pdf?src-supplier=Avnet; ComponentLink4URL: https://datasheet.ciiva.com/8001/wound02-e-8001849.pdf?src-supplier=Element14; ComponentLink4Description: https://datasheet.ciiva.com/8001/wound02-e-8001849.pdf?src-supplier=Element14; Supplier Part Number 1: 587-1602-1-ND
P1-P22 = CASTELLATED: Value: *
Q1 = FDV303N: MOSFET N-CH 25V 680MA SOT-23; Source Part Number: FDV303NCT-ND; Manufacturer: Fairchild Semiconductor; FET Type: MOSFET N-Channel, Metal Oxide; FET Feature: Logic Level Gate; Rds On (Max) @ Id, Vgs: 450 mOhm @ 500mA, 4.5V; Vgs(th) (Max) @ Id: 1.5V @ 250µA; Gate Charge (Qg) @ Vgs: 2.3nC @ 4.5V; Input Capacitance (Ciss) @ Vds: 50pF @ 10V; Power - Max: 350mW; Source: Digikey; ROHS Certificate: *; Value: FDV303N; Supplier 1: Digi-Key; Supplier Part Number 1: FDV303NCT-ND; RoHS: RoHS Compliant; Category: Discrete Semiconductor Products; Stock 1: 0; Pricing 1: 1=0.49, 10=0.347, 100=0.231, 250=0.16632, 500=0.13398, 750=0.11551, 1000=0.10395, 2000=0.0924 (USD); Drain to Source Voltage (Vdss): 25V; Current - Continuous Drain (Id) @ 25° C: 680mA; Mounting Type: Surface Mount; Package / Case: SOT-23-3, TO-236-3, Micro3™, SSD3, SST3; Packaging: Cut Tape (CT); Supplier Device Package: SOT-23; ComponentLink1URL: http://www.fairchildsemi.com/ds/FD/FDV303N.pdf; ComponentLink1Description: http://www.fairchildsemi.com/ds/FD/FDV303N.pdf; Manufacturer Part Number: FDV303N
R1 R5-R9 = ERJ-2RKF1002X: RES 10K OHM 1/10W 1% 0402 SMD; Manufacturer: Panasonic Electronic Components; Package Power: 0402  (0.1W); Power (Watts): 0.1W- 1/10W; Temperature Coefficient: ±100ppm/°C; Limiting Element Voltage: 50; Maximum Overload Voltage: 100; Maximum Working Voltage: 31.6V; Substitution Notes: 10k , ±1% , 0402 , AEC-Q200; Value: 10k; Manufacturer Part Number: ERJ-2RKF1002X; ComponentLink1Description: Internal Datasheet; ComponentLink1URL: datasheets\Panasonic Electronic Components\AOA0000CE2.pdf; ComponentLink2Description: External Datasheet; ComponentLink2URL: http://industrial.panasonic.com/www-data/pdf/AOA0000/AOA0000CE2.pdf; Supplier 1: Digi-Key; Supplier Part Number 1: P10.0KLCT-ND; Category: Resistors; Resistance (Ohms): 10k; Composition: Thick Film; Features: -; Tolerance: ±1%; Package: 0402 (1005 Metric); Supplier Package: 0402; Size / Dimension: 0.039" L x 0.020" W (1.00mm x 0.50mm); Height: 0.40MM; Number of Terminations: 2; Packaging: Cut Tape (CT); Sort Value: 10000; Sort Value Package: 402_10000; Ratings: AEC-Q200
R2 = ERJ-2RKF1912X: RES 19.1K OHM 1/10W 1% 0402 SMD; Manufacturer: Panasonic Electronic Components; Package Power: 0402  (0.1W); Power (Watts): 0.1W- 1/10W; Temperature Coefficient: ±100ppm/°C; Limiting Element Voltage: 50; Maximum Overload Voltage: 100; Maximum Working Voltage: 43.7V; Substitution Notes: 19.1k , ±1% , 0402 , AEC-Q200; Value: 19.1k; Manufacturer Part Number: ERJ-2RKF1912X; ComponentLink1Description: Internal Datasheet; ComponentLink1URL: datasheets\Panasonic Electronic Components\AOA0000CE2.pdf; ComponentLink2Description: External Datasheet; ComponentLink2URL: http://industrial.panasonic.com/www-data/pdf/AOA0000/AOA0000CE2.pdf; Supplier 1: Digi-Key; Supplier Part Number 1: P19.1KLCT-ND; Category: Resistors; Resistance (Ohms): 19.1k; Composition: Thick Film; Features: -; Tolerance: ±1%; Package: 0402 (1005 Metric); Supplier Package: 0402; Size / Dimension: 0.039" L x 0.020" W (1.00mm x 0.50mm); Height: 0.40MM; Number of Terminations: 2; Packaging: Cut Tape (CT); Sort Value: 19100; Sort Value Package: 402_19100; Ratings: AEC-Q200
R3 R4 R10 = ERJ-3EKF33R0V: RES 33 OHM 1/10W 1% 0603 SMD; Manufacturer: Panasonic Electronic Components; Package Power: 0603  (0.1W); Power (Watts): 0.1W- 1/10W; Temperature Coefficient: ±100ppm/°C; Limiting Element Voltage: 75; Maximum Overload Voltage: 150; Maximum Working Voltage: 1.8V; Substitution Notes: 33 , ±1% , 0603 , AEC-Q200; Value: 33; Manufacturer Part Number: ERJ-3EKF33R0V; ComponentLink1Description: Internal Datasheet; ComponentLink1URL: datasheets\Panasonic Electronic Components\AOA0000CE2.pdf; ComponentLink2Description: External Datasheet; ComponentLink2URL: http://industrial.panasonic.com/www-data/pdf/AOA0000/AOA0000CE2.pdf; Supplier 1: Digi-Key; Supplier Part Number 1: P33.0HCT-ND; Category: Resistors; Resistance (Ohms): 33; Composition: Thick Film; Features: -; Tolerance: ±1%; Package: 0603 (1608 Metric); Supplier Package: 0603; Size / Dimension: 0.063" L x 0.031" W (1.60mm x 0.80mm); Height: 0.55MM; Number of Terminations: 2; Packaging: Cut Tape (CT); Sort Value: 33; Sort Value Package: 603_33; Ratings: AEC-Q200
U1 = 1317: FLORA LI-PO BATTERY 3.7V 150MAH; Manufacturer: Adafruit Industries; Value: 1317; Supplier 1: Digi-Key; Manufacturer Part Number: 1317; Stock 1: 333; Pricing 1: 1=5.95000 (USD); RoHS: No; Mount: Cable; Weight: 0.01lb; Length: 2.5inch; Height: 0.5inch; Width: 1.75inch; ComponentLink1URL: http://www.mouser.com/ds/2/737/C1515_-_Li-Polymer_402025_150mAh_3.7V_with_PCM-932829.pdf?src-supplier=Mouser; ComponentLink1Description: http://www.mouser.com/ds/2/737/C1515_-_Li-Polymer_402025_150mAh_3.7V_with_PCM-932829.pdf?src-supplier=Mouser; ComponentLink2URL: https://cdn-shop.adafruit.com/product-files/1317/C1515_-_Li-Polymer_402025_150mAh_3.7V_with_PCM.pdf?src-supplier=Digi-Key; ComponentLink2Description: https://cdn-shop.adafruit.com/product-files/1317/C1515_-_Li-Polymer_402025_150mAh_3.7V_with_PCM.pdf?src-supplier=Digi-Key; Supplier Part Number 1: 1528-1839-ND
U2 = MCP73832T-2ATI/OT: Charge Controller Li-Ion/Li-Pol 15mA to 500mA 4.2V 5-Pin SOT-23 T/R; Manufacturer: Microchip; Value: MCP73832T-2ATI/OT; Supplier 1: Digi-Key; Supplier Part Number 1: MCP73832T-2ATI/OTCT-ND; Manufacturer Part Number: MCP73832T-2ATI/OT; Stock: 3196; Pricing: 1=0.56, 25=0.47, 100=0.42 (USD); RoHS: Yes; ComponentLink1URL: https://datasheet.ciiva.com/1137/630369-1137827.pdf?src-supplier=Element14; ComponentLink1Description: https://datasheet.ciiva.com/1137/630369-1137827.pdf?src-supplier=Element14; ComponentLink2URL: https://datasheet.ciiva.com/15115/getdatasheetpartid-574102-15115383.pdf?src-supplier=Verical; ComponentLink2Description: https://datasheet.ciiva.com/15115/getdatasheetpartid-574102-15115383.pdf?src-supplier=Verical; ComponentLink3URL: https://datasheet.ciiva.com/1932/21984e-1932955.pdf?src-supplier=Digi-Key; ComponentLink3Description: https://datasheet.ciiva.com/1932/21984e-1932955.pdf?src-supplier=Digi-Key; ComponentLink4URL: https://datasheet.ciiva.com/1932/21984e-1932956.pdf?src-supplier=Digi-Key; ComponentLink4Description: https://datasheet.ciiva.com/1932/21984e-1932956.pdf?src-supplier=Digi-Key; ComponentLink5URL: https://datasheet.ciiva.com/1932/21984e-1932957.pdf?src-supplier=Digi-Key; ComponentLink5Description: https://datasheet.ciiva.com/1932/21984e-1932957.pdf?src-supplier=Digi-Key; ComponentLink6URL: https://datasheet.ciiva.com/17299/21984e-17299342.pdf?src-supplier=Avnet+Europe; ComponentLink6Description: https://datasheet.ciiva.com/17299/21984e-17299342.pdf?src-supplier=Avnet+Europe
U3 = MCP1802T-3302I/OT: IC REG LINEAR 3.3V 300MA SOT23-5; Manufacturer: Microchip; Dropout Voltage: 200mV; Number of Outputs: 1; Min Input Voltage: 2V; Max Input Voltage: 10V; Max Power Dissipation: 250mW; Input Bias Current: 25uA; Polarity: Positive; Quiescent Current: 50uA; Accuracy: 2%; Output Type: Fixed; Value: MCP1802T-3302I/OT; Supplier 1: Digi-Key; Manufacturer Part Number: MCP1802T-3302I/OT; Stock 1: 3179; Pricing 1: 1=0.53000, 25=0.44000, 100=0.40000 (USD); RoHS: Yes; Mount: Surface Mount; Case/Package: SOT-23; Number of Pins: 5; Min Operating Temperature: -40°C; Max Operating Temperature: 85°C; Output Current: 300mA; Packaging: Tape and Reel; Output Voltage: 3.3V; Max Output Current: 300mA; Package Quantity: 3000; Nominal Output Voltage: 3.3V; Min Output Voltage: 3.3V; Power Dissipation: 250mW; Output Voltage Accuracy: 2%; Length: 0.122inch; Height: 0.051inch; Width: 0.071inch; Radiation Hardening: No; REACH SVHC: No SVHC; Lead Free: Lead Free; ComponentLink1URL: https://datasheet.ciiva.com/41458/001085944-da-01-en-ic-reg-ld-mcp1802t-3302i-ot-sot-23-5-mcp-41458834.pdf?src-supplier=Conrad; ComponentLink1Description: https://datasheet.ciiva.com/41458/001085944-da-01-en-ic-reg-ld-mcp1802t-3302i-ot-sot-23-5-mcp-41458834.pdf?src-supplier=Conrad; ComponentLink2URL: https://datasheet.ciiva.com/2040/22053c-2040531.pdf?src-supplier=Digi-Key; ComponentLink2Description: https://datasheet.ciiva.com/2040/22053c-2040531.pdf?src-supplier=Digi-Key; ComponentLink3URL: https://datasheet.ciiva.com/16454/filehandler-aspxddocname-en531342-16454309.pdf?src-supplier=Future+Electronics; ComponentLink3Description: https://datasheet.ciiva.com/16454/filehandler-aspxddocname-en531342-16454309.pdf?src-supplier=Future+Electronics; ComponentLink4URL: https://datasheet.ciiva.com/15200/getdatasheetpartid-626522-15200301.pdf?src-supplier=Verical; ComponentLink4Description: https://datasheet.ciiva.com/15200/getdatasheetpartid-626522-15200301.pdf?src-supplier=Verical; ComponentLink5URL: https://datasheet.ciiva.com/2040/22053c-2040529.pdf?src-supplier=Digi-Key; ComponentLink5Description: https://datasheet.ciiva.com/2040/22053c-2040529.pdf?src-supplier=Digi-Key; ComponentLink6URL: https://datasheet.ciiva.com/2040/22053c-2040530.pdf?src-supplier=Digi-Key; ComponentLink6Description: https://datasheet.ciiva.com/2040/22053c-2040530.pdf?src-supplier=Digi-Key; ComponentLink7URL: https://datasheet.ciiva.com/14562/70048283-14562246.pdf?src-supplier=Allied+Electronics; ComponentLink7Description: https://datasheet.ciiva.com/14562/70048283-14562246.pdf?src-supplier=Allied+Electronics; ComponentLink8URL: https://datasheet.ciiva.com/46395/808935-46395672.pdf?src-supplier=Element14; ComponentLink8Description: https://datasheet.ciiva.com/46395/808935-46395672.pdf?src-supplier=Element14; ComponentLink9URL: https://datasheet.ciiva.com/8239/jp531342-8239437.pdf?src-supplier=Avnet; ComponentLink9Description: https://datasheet.ciiva.com/8239/jp531342-8239437.pdf?src-supplier=Avnet; Supplier Part Number 1: MCP1802T-3302I/OTCT-ND
U4 = PRTR5V0U2X,215: TVS DIODE 5.5VWM SOT143B; Manufacturer: NXP Semiconductors; Bidirectional Channels: 2; Voltage - Reverse Standoff (Typ): 5.5V (Max); Voltage - Breakdown (Min): 6V; Power Line Protection: Yes; Capacitance @ Frequency: 1pF @ 1MHz; Supplier 1: Digi-Key; Supplier Part Number 1: 568-4140-1-ND; Manufacturer Part Number: PRTR5V0U2X,215; RoHS: RoHS Compliant; Category: Circuit Protection; Stock: 11734; Pricing: 1=0.57, 10=0.477, 25=0.418, 100=0.3578, 250=0.31036, 500=0.26286, 1000=0.20265 (USD); Packaging: Cut Tape (CT); Type: Steering (Rail to Rail); Unidirectional Channels: -; Voltage - Clamping (Max) @ Ipp: -; Current - Peak Pulse (10/1000µs): -; Power - Peak Pulse: -; Applications: General Purpose; Operating Temperature: -40°C ~ 85°C (TA); Mounting Type: Surface Mount; Package / Case: TO-253-4, TO-253AA; Supplier Device Package: SOT-143B; ComponentLink1URL: http://www.nxp.com/documents/data_sheet/PRTR5V0U2X.pdf; ComponentLink1Description: http://www.nxp.com/documents/data_sheet/PRTR5V0U2X.pdf; Value: PRTR5V0U2X,215
U5 = LPC55S69JEV98K: IC MCU 100MHZ CORTEX M33 DUAL; Manufacturer: NXP Semiconductors; Value: LPC55S69JEV98K; Supplier 1: Mouser; Supplier Part Number 1: 771-LPC55S69JEV98K; Manufacturer Part Number: LPC55S69JEV98K; RoHS: No; Stock: 2365; Pricing: 1=6.94000, 10=6.27000, 25=5.98000, 100=5.19000, 250=4.96000, 500=4.52000 (USD)
U6 = SPH0645LM4H-B: 20Hz ~ 10kHz Digital, I²S Microphone MEMS (Silicon) 1.8V Omnidirectional (-26dB ±3dB @ 94dB SPL) Solder Pads; Manufacturer: Knowles Acoustics; Shape: Rectangular; Operating Supply Current: 600uA; Value: SPH0645LM4H-B; Manufacturer Part Number: SPH0645LM4H-B; Supplier 1: Digi-Key; Supplier Part Number 1: 423-1405-1-ND; Stock 1: 13538; Pricing 1: 1=2.97, 10=2.357, 25=2.1448, 50=2.0076, 100=1.8704, 250=1.70832, 500=1.58364, 1000=1.5587 (USD); Packaging: Tape and Reel; Direction: Omnidirectional; Voltage Rating: 1.8V; Termination: Solder; Output Type: Digital; Length: 3.5mm; Height: 1.08mm; Width: 2.65mm; ComponentLink1URL: http://www.knowles.com/eng/content/download/5988/105771/version/4/file/SPH0645LM4H-BRevB.PDF; ComponentLink1Description: http://www.knowles.com/eng/content/download/5988/105771/version/4/file/SPH0645LM4H-BRevB.PDF; ComponentLink2URL: https://media.digikey.com/pdf/Data%20Sheets/Knowles%20Acoustics%20PDFs/SPH0645LM4H-B.pdf; ComponentLink2Description: https://media.digikey.com/pdf/Data%20Sheets/Knowles%20Acoustics%20PDFs/SPH0645LM4H-B.pdf
U7 = ER-TFT1.54-1: 1.54" 240x240 IPS Display; Manufacturer: Buy Display; Value: ER-TFT1.54-1; Manufacturer Part Number: ER-TFT1.54-1
U9 = ABM3-16.000MHZ-B2-T: Crystal 16MHz ±20ppm (Tol) ±50ppm (Stability) 18pF FUND 50Ohm 2-Pin CSMD T/R; Manufacturer: Abracon; ESR (Equivalent Series Resistance): 40R; Series Resistance: 60R; Value: 16MHz; Supplier 1: Digi-Key; Supplier Part Number 1: 535-9103-1-ND; Manufacturer Part Number: ABM3-16.000MHZ-B2-T; RoHS: Yes; Category: Crystals; Stock: 9690; Pricing: 1=0.66000, 10=0.55300, 50=0.49780, 100=0.44260, 500=0.42044 (USD); Mount: Surface Mount; Case/Package: CSMD; Number of Pins: 2; Min Operating Temperature: -20°C; Max Operating Temperature: 70°C; Frequency: 16MHz; Load Capacitance: 18pF; Packaging: Tape and Reel; Frequency Tolerance: 20ppm; Package Quantity: 1000; Tolerance: 20ppm; Frequency Stability: 50ppm; Termination: SMD/SMT; Composition: Ceramic; Accuracy: 20ppm; Length: 5mm; Height: 0.051inch; Width: 3.2mm; Depth: 3.2mm; REACH SVHC: Yes; Lead Free: Lead Free; ComponentLink1URL: https://datasheet.ciiva.com/15116/getdatasheetpartid-719852-15116752.pdf?src-supplier=Verical; ComponentLink1Description: https://datasheet.ciiva.com/15116/getdatasheetpartid-719852-15116752.pdf?src-supplier=Verical; ComponentLink2URL: https://datasheet.ciiva.com/4945/abm3-47699-4945240.pdf?src-supplier=Mouser; ComponentLink2Description: https://datasheet.ciiva.com/4945/abm3-47699-4945240.pdf?src-supplier=Mouser; ComponentLink3URL: https://datasheet.ciiva.com/855/abm3-855737.pdf?src-supplier=Digi-Key; ComponentLink3Description: https://datasheet.ciiva.com/855/abm3-855737.pdf?src-supplier=Digi-Key; ComponentLink4URL: https://datasheet.ciiva.com/855/abm3-855738.pdf?src-supplier=Digi-Key; ComponentLink4Description: https://datasheet.ciiva.com/855/abm3-855738.pdf?src-supplier=Digi-Key; ComponentLink5URL: https://datasheet.ciiva.com/855/abm3-855739.pdf?src-supplier=Digi-Key; ComponentLink5Description: https://datasheet.ciiva.com/855/abm3-855739.pdf?src-supplier=Digi-Key; ComponentLink6URL: https://datasheet.ciiva.com/16209/abm3-16209965.pdf?src-supplier=Future+Electronics; ComponentLink6Description: https://datasheet.ciiva.com/16209/abm3-16209965.pdf?src-supplier=Future+Electronics
U10 = OPA340: Manufacturer: Texas Instruments; Manufacturer Part Number: OPA340NA/250; Source Part Number: OPA340NACT-ND; Source: Digikey; ROHS Certificate: ROHS-TI.pdf

## Assembly variants
A: all parts fitted